# Altium schematic sheet ESP32.SchDoc
size A3; SheetNumber: 2; SheetTotal: 15
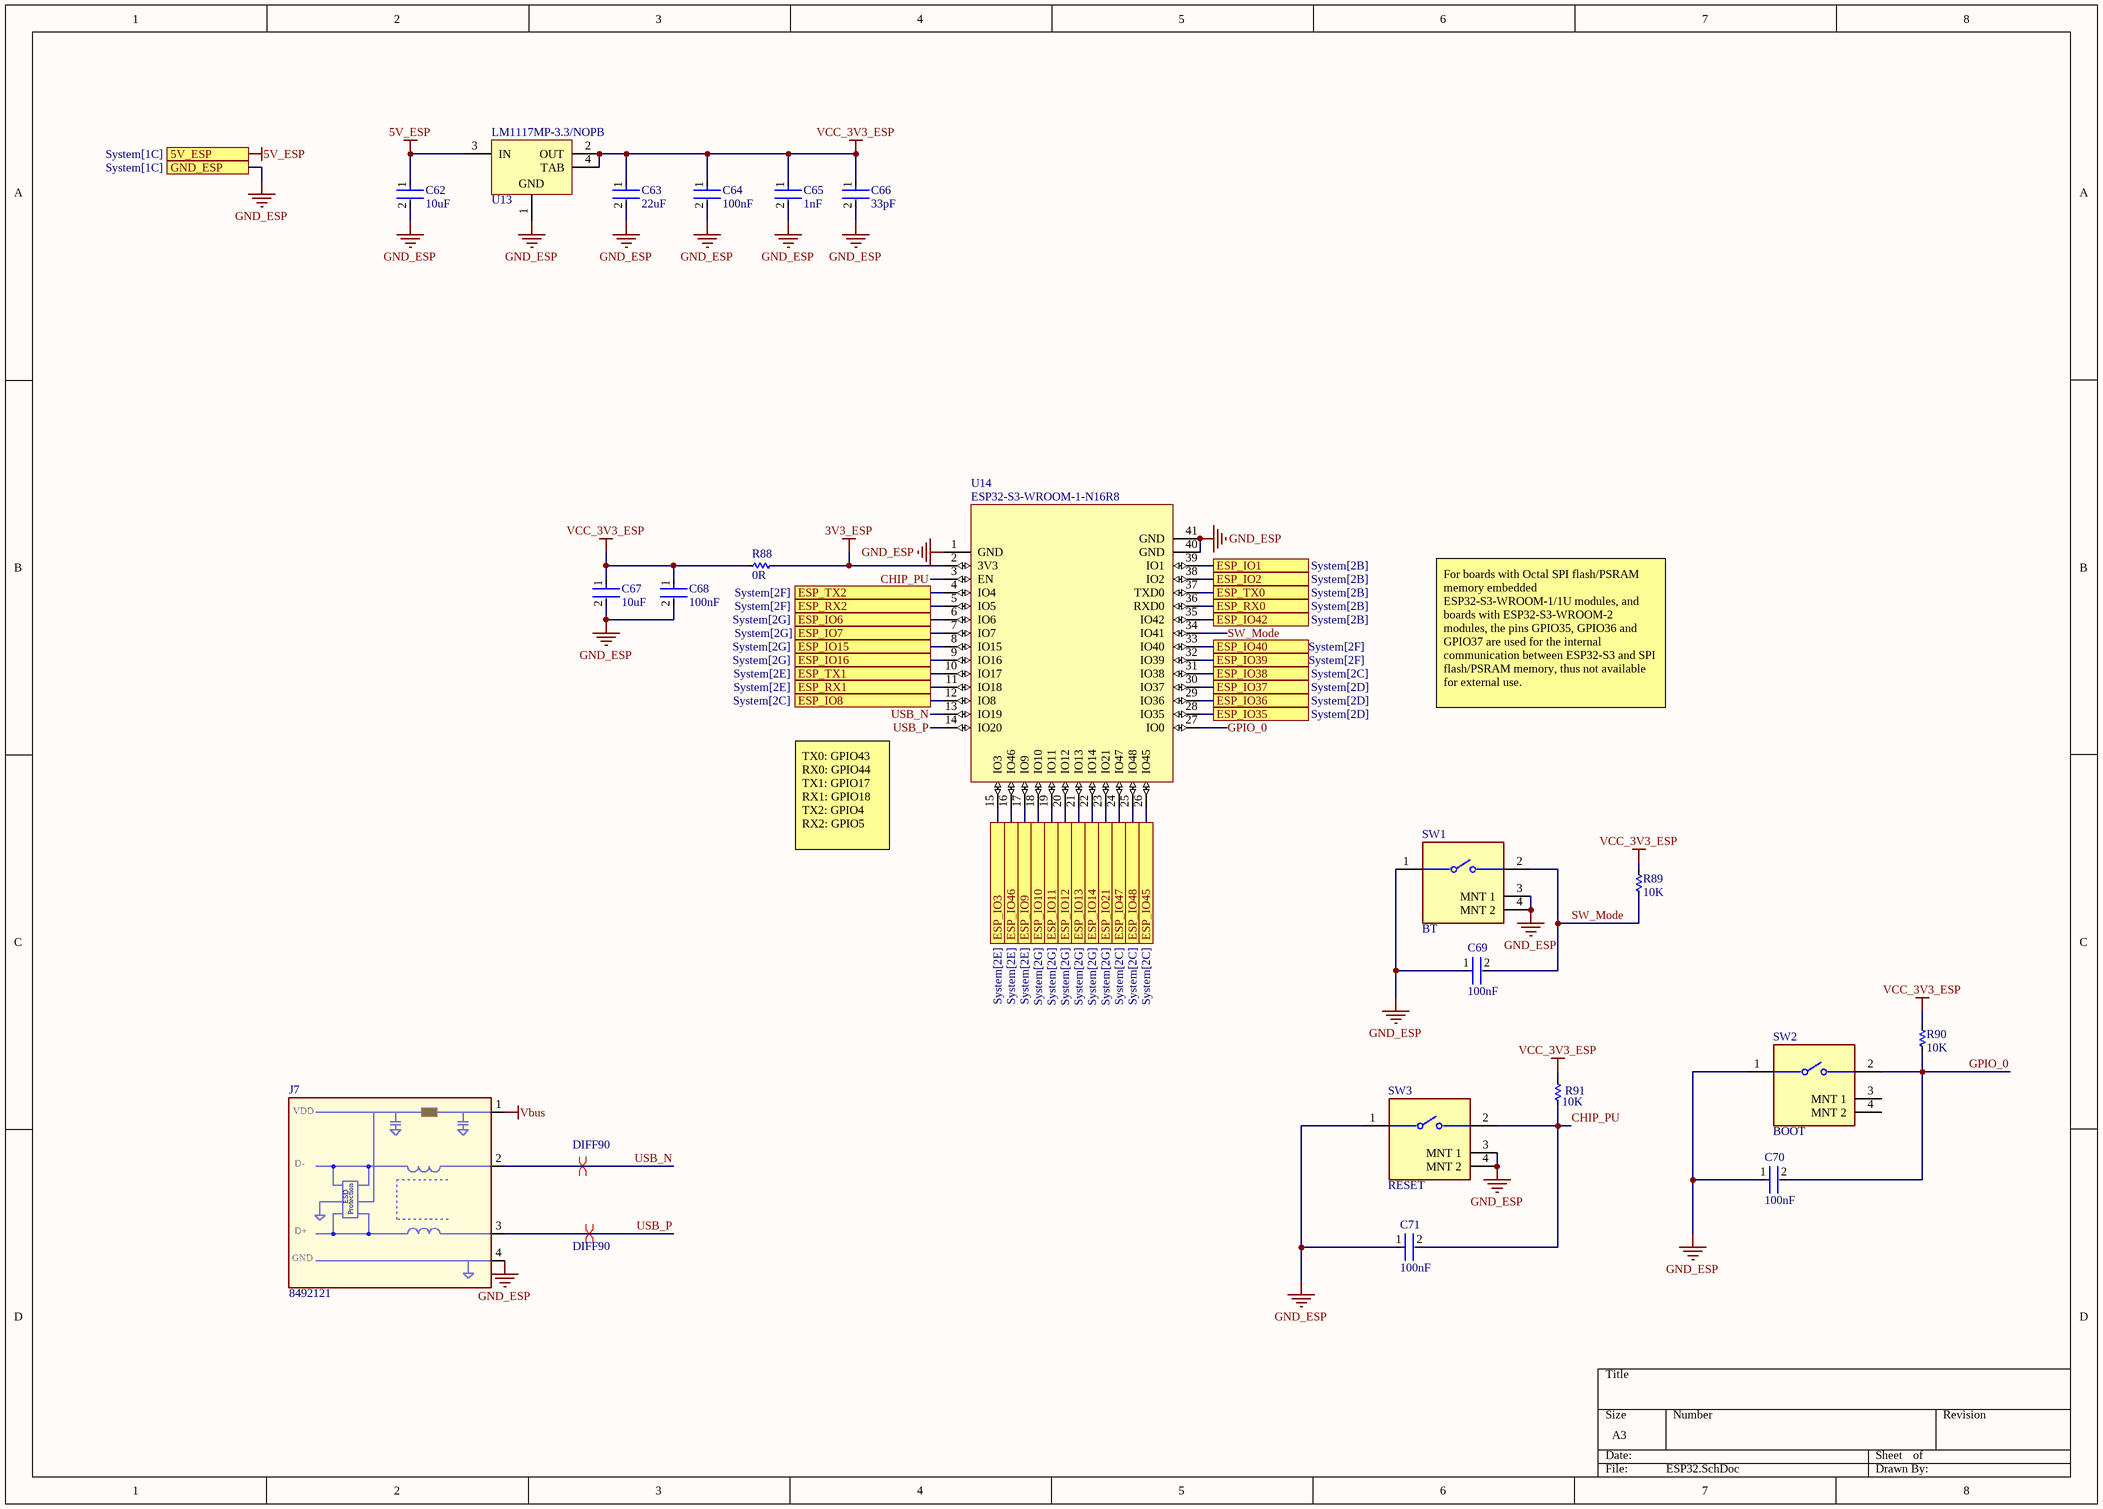
[diagram p0: ESP32.SchDoc]

## Parts
C62  10uF  [FP-GRM188-0_1-e0_2_0_55-IPC_A]
C63  22uF  [FP-GRM188-0_1-e0_2_0_55-IPC_A]
C64  100nF  [FP-GRM188-0_1-e0_2_0_55-IPC_A]
C65  1nF  [FP-GRM188-0_1-e0_2_0_55-IPC_A]
C66  33pF  [FP-GRM188-0_1-e0_2_0_55-IPC_A]
C67  10uF  [FP-GRM188-0_1-e0_2_0_55-IPC_A]
C68  100nF  [FP-GRM188-0_1-e0_2_0_55-IPC_A]
C69  100nF  [FP-GRM188-0_1-e0_2_0_55-IPC_A]
C70  100nF  [FP-CGA3E-0_3-0_1-IPC_A]
C71  100nF  [FP-CGA3E-0_3-0_1-IPC_A]
J7  8492121  [USB-C2]
R88  0R  [RES-SMD-0603]
R89  10K  [RES-SMD-0603]
R90  10K  [RES-SMD-0603]
R91  10K  [RES-SMD-0603]
SW1  BT  [FP-1825027-8-MFG]
SW2  BOOT  [FP-1825027-8-MFG]
SW3  RESET  [FP-1825027-8-MFG]
U13  LM1117MP-3.3/NOPB  [DCY0004A_M]
U14  ESP32-S3-WROOM-1-N16R8  [ESP32S3WROOM1N8R2]

## Ports
5V_ESP (see System[1C]), ESP_IO1 (see System[2B]), ESP_IO2 (see System[2B]), ESP_IO3 (see System[2E]), ESP_IO6 (see System[2G]), ESP_IO7 (see System[2G]), ESP_IO8 (see System[2C]), ESP_IO9 (see System[2E]), ESP_IO10 (see System[2G]), ESP_IO11 (see System[2G]), ESP_IO12 (see System[2G]), ESP_IO13 (see System[2G]), ESP_IO14 (see System[2G]), ESP_IO15 (see System[2G]), ESP_IO16 (see System[2G]), ESP_IO21 (see System[2G]), ESP_IO35 (see System[2D]), ESP_IO36 (see System[2D]), ESP_IO37 (see System[2D]), ESP_IO38 (see System[2C]), ESP_IO39 (see System[2F]), ESP_IO40 (see System[2F]), ESP_IO42 (see System[2B]), ESP_IO45 (see System[2C]), ESP_IO46 (see System[2E]), ESP_IO47 (see System[2C]), ESP_IO48 (see System[2C]), ESP_RX0 (see System[2B]), ESP_RX1 (see System[2E]), ESP_RX2 (see System[2F]), ESP_TX0 (see System[2B]), ESP_TX1 (see System[2E]), ESP_TX2 (see System[2F]), GND_ESP (see System[1C])

## Nets
3V3_ESP: R88.1 U14.2(3V3)
5V_ESP: C62.1 U13.3(IN) ; port 5V_ESP
GND_ESP: C62.2 C63.2 C64.2 C65.2 C66.2 C67.2 C68.2 C69.1 C70.1 C71.1 J7.4(GND) SW1.1 SW1.3(MNT_1) SW1.4(MNT_2) SW2.1 SW3.1 SW3.3(MNT_1) SW3.4(MNT_2) U13.1(GND) U14.1(GND) U14.40(GND) U14.41(GND) ; port GND_ESP
Vbus: J7.1(VBUS)
VCC_3V3_ESP: C63.1 C64.1 C65.1 C66.1 C67.1 C68.1 R88.2 R89.2 R90.2 R91.2 U13.2(OUT) U13.4(TAB)
CHIP_PU: C71.2 R91.1 SW3.2 U14.3(EN)
ESP_IO1: U14.39(IO1) ; port ESP_IO1
ESP_IO2: U14.38(IO2) ; port ESP_IO2
ESP_IO3: U14.15(IO3) ; port ESP_IO3
ESP_IO6: U14.6(IO6) ; port ESP_IO6
ESP_IO7: U14.7(IO7) ; port ESP_IO7
ESP_IO8: U14.12(IO8) ; port ESP_IO8
ESP_IO9: U14.17(IO9) ; port ESP_IO9
ESP_IO10: U14.18(IO10) ; port ESP_IO10
ESP_IO11: U14.19(IO11) ; port ESP_IO11
ESP_IO12: U14.20(IO12) ; port ESP_IO12
ESP_IO13: U14.21(IO13) ; port ESP_IO13
ESP_IO14: U14.22(IO14) ; port ESP_IO14
ESP_IO15: U14.8(IO15) ; port ESP_IO15
ESP_IO16: U14.9(IO16) ; port ESP_IO16
ESP_IO21: U14.23(IO21) ; port ESP_IO21
ESP_IO35: U14.28(IO35) ; port ESP_IO35
ESP_IO36: U14.29(IO36) ; port ESP_IO36
ESP_IO37: U14.30(IO37) ; port ESP_IO37
ESP_IO38: U14.31(IO38) ; port ESP_IO38
ESP_IO39: U14.32(IO39) ; port ESP_IO39
ESP_IO40: U14.33(IO40) ; port ESP_IO40
ESP_IO42: U14.35(IO42) ; port ESP_IO42
ESP_IO45: U14.26(IO45) ; port ESP_IO45
ESP_IO46: U14.16(IO46) ; port ESP_IO46
ESP_IO47: U14.24(IO47) ; port ESP_IO47
ESP_IO48: U14.25(IO48) ; port ESP_IO48
ESP_RX0: U14.36(RXD0) ; port ESP_RX0
ESP_RX1: U14.11(IO18) ; port ESP_RX1
ESP_RX2: U14.5(IO5) ; port ESP_RX2
ESP_TX0: U14.37(TXD0) ; port ESP_TX0
ESP_TX1: U14.10(IO17) ; port ESP_TX1
ESP_TX2: U14.4(IO4) ; port ESP_TX2
GPIO_0: C70.2 R90.1 SW2.2 U14.27(IO0)
SW_Mode: C69.2 R89.1 SW1.2 U14.34(IO41)
USB_N: J7.2(D-) U14.13(IO19)
USB_P: J7.3(D+) U14.14(IO20)

Not connected (* = marked no-connect by the designer): SW2 3(MNT_1) 4(MNT_2)

## Layout directives
differential pair; differential pair class DIFF90: USB_N, USB_P

## Notes on the sheet
- For boards with Octal SPI flash/PSRAM memory embedded ESP32-S3-WROOM-1/1U modules, and boards with ESP32-S3-WROOM-2 modules, the pins GPIO35, GPIO36 and GPIO37 are used for the internal communication between ESP32-S3 and SPI flash/PSRAM memory, thus not available for external use.
- TX0: GPIO43
  RX0: GPIO44
  TX1: GPIO17
  RX1: GPIO18
  TX2: GPIO4
  RX2: GPIO5
- (in symbol USB-4) VDD; ESD; Protection

## Library data of the parts
C62 C67 = CMP-2006-02792-2: Chip Multilayer Ceramic Capacitors for General Purpose, 0603; Voltage Rating (DC): 6.3V; Dielectric: X5R; Tolerance: 20%; Packaging: Tape and Reel; Width: 0.031inch; Termination: SMD/SMT; Package Quantity: 4000; Voltage Rating: 6.3V; Capacitance: 10uF; Case/Package: 0603; Min Operating Temperature: -55°C; Voltage: 6.3V; Length: 1.6mm; Thickness: 0.035inch; Lead Free: Lead Free; Depth: 0.8mm; Case Code (Imperial): 0603; Max Operating Temperature: 85°C; Material: Ceramic; Height: 0.8mm; Mount: Surface Mount; REACH SVHC: No SVHC; Radiation Hardening: No; Case Code (Metric): 1608
C63-C66 C68 C69 = CMP-2006-02792-2: Chip Multilayer Ceramic Capacitors for General Purpose, 0603; Voltage Rating (DC): 6.3V; Dielectric: X5R; Capacitance: 10uF; Tolerance: 20%; Packaging: Tape and Reel; Width: 0.031inch; Termination: SMD/SMT; Package Quantity: 4000; Voltage Rating: 6.3V; Case/Package: 0603; Min Operating Temperature: -55°C; Voltage: 6.3V; Length: 1.6mm; Thickness: 0.035inch; Lead Free: Lead Free; Depth: 0.8mm; Case Code (Imperial): 0603; Max Operating Temperature: 85°C; Material: Ceramic; Height: 0.8mm; Mount: Surface Mount; REACH SVHC: No SVHC; Radiation Hardening: No; Case Code (Metric): 1608
C70 C71 = CMP-2000-07546-2: Cap Ceramic 100nF 50V X7R 10% Pad SMD 0603 +125°C Automotive T/R; Weight: 7.1E-05oz; Composition: Ceramic; Max Operating Temperature: 125°C; Termination: SMD/SMT; Dielectric: X7R; Length: 1.6mm; Package Quantity: 1; REACH SVHC: No SVHC; Lead Free: Lead Free; Case Code (Metric): 1608; Min Operating Temperature: -55°C; Packaging: Tape and Reel; Tolerance: 10%; Voltage Rating: 50V; Case Code (Imperial): 0603; Capacitance: 100nF; Case/Package: 0603; Voltage Rating (DC): 50V; Depth: 0.8mm; Radiation Hardening: No; Ratings: AEC-Q200; Mount: Surface Mount; Voltage: 50V; Thickness: 0.035inch; Width: 0.8mm; Height: 0.8mm
J7 = USB-4: THT USB 2.0 A Connector WE-EPLE; Manufacturer: Würth Elektronik eiSos GmbH; PartNo: 8492121; ComponentLink1Description: Manufacturer; ComponentLink1URL: http://www.we-online.de; Created by: Christin Otto; Created Date: OCT-2014; ComponentLink2Description: Datasheet; ComponentLink2URL: http://www.we-online.de/katalog/media/pdf/8492121.pdf
R88-R91 = Res-SMD: Resistor 0603; Manufacturer: Generic Components; Class: Passive; Published: 08/06/2000; Publisher: Altium Hobart Technology Centre
SW1-SW3 = CMP-2000-05515-2: SWITCH TACTILE SPST-NO 0.05A 24V; Manufacturer: TE Connectivity; Manufacturer Part Number: 1825027-8; Operating Force: 1.6N; Contact Resistance: 100mΩ; Contact Current Rating: 50mA; Electromechanical Life: 100000Cycles; Temperature: -35°C to +85°C; Lead Free: Yes; Device Class L1: Electromechanical; ComponentLink2Description: Datasheet; Temperature Range Low: -35°C; Voltage Rating Dc: 24V; RoHS: TRUE; Mount: Through Hole; Temperature Range High: +85°C; Octopart: https://octopart.com/1825027-8-te+connectivity-41891101; ComponentLink2URL: https://www.te.com/commerce/DocumentDelivery/DDEController?Action=showdoc&DocId=Customer+Drawing%7F1825027%7FG4%7Fpdf%7FEnglish%7FENG_CD_1825027_G4.pdf%7F1825027-8; Height: 7.31mm; Automotive: No; Mouser Description: Tactile Switches R/A TACT 160G PB SWITCH; Digikey Description: SWITCH TACTILE SPST-NO 0.05A 24V; Category: Switch; Device Class L3: Pushbutton Switches; Package: 1825027-8; Device Class L2: Switches; Throw Configuration: SPST-NO
U13 = CMP-0062-01638-4: 800mA Low-Dropout Linear Regulator, 4-pin SOT-223, Pb-Free; Manufacturer: Texas Instruments; CompType: LDO IC; PackageTopMarking: XYTT*N05A; High-Reliability: Y; PowerWise: N; ComponentLink1URL: http://www.ti.com/general/docs/lit/getliterature.tsp?genericPartNumber=LM1117-N&fileType=pdf; PinCount: 4; PackageDescription: Molded SOT-223, 6.50 x 3.56 x 1.6mm Body, 4 Lead, 2.3mm Pitch; Code_IPC: SOT223-4; PartNumber: LM1117MP-3.3/NOPB; Code_JEDEC: TO-261-AA; RoHS: Y; PackageReference: DCY0004A; ComponentLink1Description: Datasheet URL
U14 = ESP32-S3-WROOM-1-N16R8: Bluetooth, WiFi 802.11b/g/n, Bluetooth v5.0 Transceiver Module 2.4GHz PCB Trace Surface Mount; MF: Espressif Systems; SnapEDA_Link: https://www.snapeda.com/parts/ESP32-S3-WROOM-1-N16R8/Espressif+Systems/view-part/?ref=snap; Package: NON STANDARD Espressif Systems; Value: *; MP: ESP32-S3-WROOM-1-N16R8; Check_prices: https://www.snapeda.com/parts/ESP32-S3-WROOM-1-N16R8/Espressif+Systems/view-part/?ref=eda